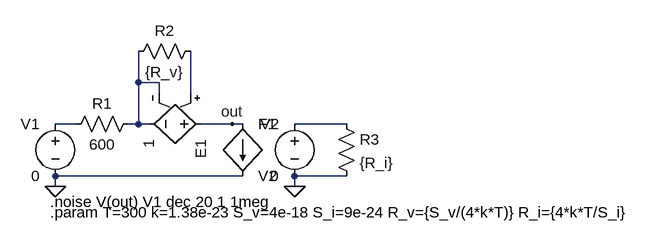
[diagram p0: schematic ExNoiseFigureAmpLTspice.asc]
ExNoiseFigureAmpLTspice.asc, the LTspice schematic file:
Version 4
SHEET 1 880 680
WIRE 96 -160 96 -208
WIRE 128 -160 96 -160
WIRE 128 -144 128 -160
WIRE 176 -144 176 -208
WIRE 0 -96 -32 -96
WIRE 96 -96 96 -160
WIRE 96 -96 80 -96
WIRE 112 -96 96 -96
WIRE 240 -96 192 -96
WIRE 256 -96 240 -96
WIRE 416 -96 336 -96
WIRE 256 -16 -32 -16
WIRE 416 -16 336 -16
WIRE -32 0 -32 -16
WIRE 336 0 336 -16
FLAG -32 0 0
FLAG 336 0 0
FLAG 240 -96 out
SYMBOL res 96 -112 R90
WINDOW 0 0 56 VBottom 2
WINDOW 3 32 56 VTop 2
SYMATTR InstName R1
SYMATTR Value 600
SYMBOL voltage -32 -112 M0
SYMATTR InstName V1
SYMATTR Value 0
SYMBOL e 208 -96 R90
SYMATTR InstName E1
SYMATTR Value 1
SYMBOL res 192 -224 R90
WINDOW 0 0 56 VBottom 2
WINDOW 3 32 56 VTop 2
SYMATTR InstName R2
SYMATTR Value {R_v}
SYMBOL f 256 -96 R0
SYMATTR InstName F1
SYMATTR Value V2
SYMATTR Value2 1
SYMBOL voltage 336 -112 M0
WINDOW 123 0 0 Left 0
WINDOW 39 0 0 Left 0
SYMATTR InstName V2
SYMATTR Value 0
SYMBOL res 400 -112 R0
SYMATTR InstName R3
SYMATTR Value {R_i}
TEXT -40 24 Left 2 !.noise V(out) V1 dec 20 1 1meg
TEXT -40 40 Left 2 !.param T=300 k=1.38e-23 S_v=4e-18 S_i=9e-24 R_v={S_v/(4*k*T)} R_i={4*k*T/S_i}

The netlist it stands for:
* ExNoiseFigureAmpLTspice.asc
R1 N001 N003 600
V1 N003 0 0
E1 out N001 N002 N001 1
R2 N002 N001 {R_v}
F1 out 0 V2 1
V2 N004 0 0
R3 N004 0 {R_i}
.noise V(out) V1 dec 20 1 1meg
.param T=300 k=1.38e-23 S_v=4e-18 S_i=9e-24 R_v={S_v/(4*k*T)} R_i={4*k*T/S_i}
.backanno
.end